# Altium schematic sheet PX4FMUv2.4.6_06.SchDoc: PX4FMUv2.4.6.sch
size 282 x 200 mm; Date: 2015/3/26 21:06:19; SheetNumber: Sheet:
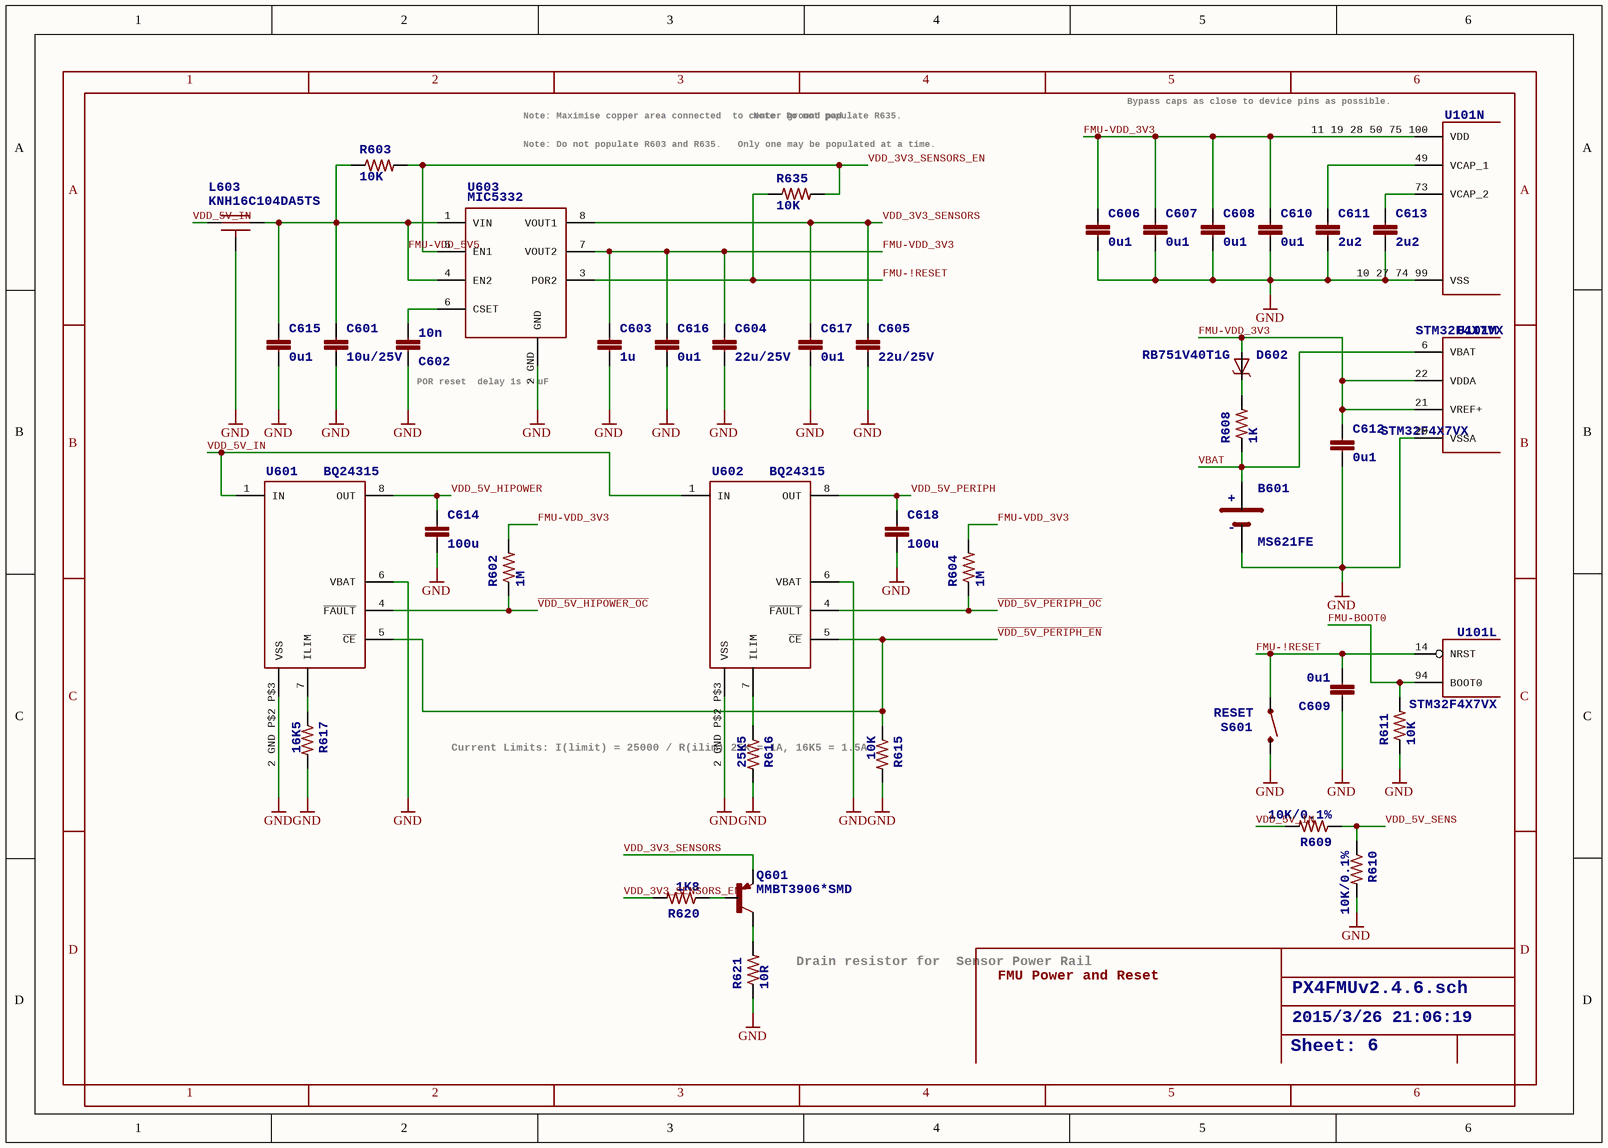
[diagram p0: PX4FMUv2.4.6_06.SchDoc]

## Parts
B601  MS621FE  [MS621FE]
C601  10u/25V  [0805-CAP]
C602  10n  [0402-CAP]
C603  1u  [0603-CAP]
C604  22u/25V  [0805-CAP]
C605  22u/25V  [0805-CAP]
C606  0u1  [0402-CAP]
C607  0u1  [0402-CAP]
C608  0u1  [0402-CAP]
C609  0u1  [0402-CAP]
C610  0u1  [0402-CAP]
C611  2u2  [0603-CAP]
C612  0u1  [0402-CAP]
C613  2u2  [0603-CAP]
C614  100u  [1206-CAP]
C615  0u1  [0402-CAP]
C616  0u1  [0402-CAP]
C617  0u1  [0402-CAP]
C618  100u  [1206-CAP]
D602  RB751V40T1G  [SOD323]
L603  KNH16C104DA5TS  [KYOCERA-KNH16-DA]
Q601  MMBT3906*SMD  [SOT23-BEC]
R602  1M  [0402-RES]
R603  10K  [0402-RES]
R604  1M  [0402-RES]
R608  1K  [0402-RES]
R609  10K/0.1%  [0402-RES]
R610  10K/0.1%  [0402-RES]
R611  10K  [0402-RES]
R615  10K  [0402-RES]
R616  25K5  [0402-RES]
R617  16K5  [0402-RES]
R620  1K8  [0402-RES]
R621  10R  [0603-RES]
R635  10K  [0402-RES]
S601  RESET  [EVQP7J01K]
U101  STM32F4X7VX  [TQFP100]  (parts L,M,N of 14)
U601  BQ24315  [QFN8-DSG]
U602  BQ24315  [QFN8-DSG]
U603  MIC5332  [MLF-8-EPAD]

## Nets
GND: B601.2(NEG) C601.P$2 C602.P$1 C603.P$2 C604.P$2 C605.P$2 C606.P$2 C607.P$2 C608.P$2 C609.P$1 C610.P$2 C611.P$2 C612.P$2 C613.P$2 C614.P$2 C615.P$2 C616.P$2 C617.P$2 C618.P$2 L603.P$3_P$4_P$5(P$3) R610.P$2 R611.P$1 R615.P$2 R616.P$2 R617.P$2 R621.1 S601.B3 U101.10_27_74_99(VSS) U101.20(VSSA) U601.2_GND_P$2_P$3(VSS) U601.6(VBAT) U602.2_GND_P$2_P$3(VSS) U602.6(VBAT) U603.2_GND(GND)
FMU-!RESET: C609.P$2 R635.P$1 S601.A1 U101.14(NRST) U603.3(POR2)
FMU-BOOT0: R611.P$2 U101.94(BOOT0)
FMU-VDD_3V3: C603.P$1 C604.P$1 C606.P$1 C607.P$1 C608.P$1 C610.P$1 C612.P$1 C616.P$1 D602.A R602.P$2 R604.P$2 U101.11_19_28_50_75_100(VDD) U101.21(VREF+) U101.22(VDDA) U603.7(VOUT2)
FMU-VDD_5V5: C601.P$1 C615.P$1 L603.P$2 R603.P$1 U603.1(VIN) U603.4(EN2)
~{VDD_5V_HIPOWER_OC}: R602.P$1 U601.4(~{FAULT})
~{VDD_5V_PERIPH_EN}: R615.P$1 U601.5(~{CE}) U602.5(~{CE})
~{VDD_5V_PERIPH_OC}: R604.P$1 U602.4(~{FAULT})
VBAT: B601.1(POS) R608.P$1 U101.6(VBAT)
VDD_3V3_SENSORS: C605.P$1 C617.P$1 Q601.E U603.8(VOUT1)
VDD_3V3_SENSORS_EN: R603.P$2 R620.P$2 R635.P$2 U603.5(EN1)
VDD_5V_HIPOWER: C614.P$1 U601.8(OUT)
VDD_5V_IN: L603.P$1 R609.P$2 U601.1(IN) U602.1(IN)
VDD_5V_PERIPH: C618.P$1 U602.8(OUT)
VDD_5V_SENS: R609.P$1 R610.P$1
NetC602_P$2: C602.P$2 U603.6(CSET)
NetC611_P$1: C611.P$1 U101.49(VCAP_1)
NetC613_P$1: C613.P$1 U101.73(VCAP_2)
NetD602_C: D602.C R608.P$2
NetQ601_B: Q601.B R620.P$1
NetQ601_C: Q601.C R621.2
NetR616_P$1: R616.P$1 U602.7(ILIM)
NetR617_P$1: R617.P$1 U601.7(ILIM)

## Notes on the sheet
- Note: Maximise copper area connected
  to center ground pad.
- (near R635) Note: Do not populate R603 and R635.
  Only one may be populated at a time.
- Note: Do not populate R635.
- Bypass caps as close to device pins as possible.
- POR reset
  delay 1s / uF
- (near R616) Current Limits:
  I(limit) = 25000 / R(ilim)
  25K = 1A, 16K5 = 1.5A
- Drain resistor for
  Sensor Power Rail
- FMU Power and Reset
- 1
- 2
- 3
- 4
- 5
- 6
- A
- B
- C
- D

## Library data of the parts
B601 = MS621FE: <b>SEIKO 6.8mm Rechargeable 3V lithium battery<b> / <br> / <br> / <b>If discontinued or not available, similar devices are available from Panasonic and Sanyo, usually direct replacements.<b>; PARTNO: MS621FE-FL11E; DATASHEET: http://speed.sii.co.jp/data/file_PRODUCT_MASTER_50112_TITLE_IMAGESP.pdf; LINK: http://search.digikey.com/us/en/products/MS621FE-FL11E/728-1057-ND/1889208; MFGPN: MS621FE; +: +; -: -
C601 = CAP0805: <b>Capacitor</b> / Standard 0603 ceramic capacitor, and 0.1" leaded capacitor.; PARTNO: CL21A106KAYNNNE
C602 = CAP0402: <b>Capacitor</b> / Standard 0603 ceramic capacitor, and 0.1" leaded capacitor.; PARTNO: CC0402KRX7R7BB103
C603 = CAP0603: <b>Capacitor</b> / Standard 0603 ceramic capacitor, and 0.1" leaded capacitor.; PARTNO: CC0603ZRY5V7BB105
C604 C605 = CAP0805: <b>Capacitor</b> / Standard 0603 ceramic capacitor, and 0.1" leaded capacitor.; PARTNO: CL21A226MAQNNNE
C606-C610 C612 C615-C617 = CAP0402: <b>Capacitor</b> / Standard 0603 ceramic capacitor, and 0.1" leaded capacitor.; PARTNO: CC0402ZRY5V7BB104
C611 C613 = CAP0603: <b>Capacitor</b> / Standard 0603 ceramic capacitor, and 0.1" leaded capacitor.; PARTNO: C1608X6S1C225K080AC
C614 C618 = CAP1206: <b>Capacitor</b> / Standard 0603 ceramic capacitor, and 0.1" leaded capacitor.; PARTNO: C3216X5R1A107M160AC
D602 = DIODE-SCHOTTKY_SOD323: Schottky barrier diode in DO214AC, e.g. Fairchild SS14.
L603 = KNH16C104DA5TS: Kyocera KNH16C104DA5TS EMI filter; PARTNO: KNH16C104DA5TS
Q601 = MMBT3906*SMD: <b>PNP Transistror</b>
R602 R604 = RESISTOR0402-RES: <b>Resistor</b> / Basic schematic elements and footprints for 0603, 1206, and PTH 1/10th watt (small) resistors.; PARTNO: RC0402FR-071ML
R603 R611 R615 = RESISTOR0402-RES: <b>Resistor</b> / Basic schematic elements and footprints for 0603, 1206, and PTH 1/10th watt (small) resistors.; PARTNO: RC0402FR-0710KL
R608 = RESISTOR0402-RES: <b>Resistor</b> / Basic schematic elements and footprints for 0603, 1206, and PTH 1/10th watt (small) resistors.; PARTNO: RC0402FR-071KL
R609 R610 = RESISTOR0402-RES: <b>Resistor</b> / Basic schematic elements and footprints for 0603, 1206, and PTH 1/10th watt (small) resistors.; PARTNO: ERA-2AEB103X
R616 = RESISTOR0402-RES: <b>Resistor</b> / Basic schematic elements and footprints for 0603, 1206, and PTH 1/10th watt (small) resistors.; PARTNO: RMCF0402FT25K5
R617 = RESISTOR0402-RES: <b>Resistor</b> / Basic schematic elements and footprints for 0603, 1206, and PTH 1/10th watt (small) resistors.; PARTNO: RMCF0402FT16K5
R620 = RESISTOR0402-RES: <b>Resistor</b> / Basic schematic elements and footprints for 0603, 1206, and PTH 1/10th watt (small) resistors.; PARTNO: RC1005F182CS
R621 = RESISTOR0603-RES: <b>Resistor</b> / Basic schematic elements and footprints for 0603, 1206, and PTH 1/10th watt (small) resistors.; PARTNO: RC1608J100CS
R635 = RESISTOR0402-RES: <b>Resistor</b> / Basic schematic elements and footprints for 0603, 1206, and PTH 1/10th watt (small) resistors.; PARTNO: RC0402FR-0710KL; BOM: EXCLUDE
S601 = SWITCH-MOMENTARY-2
U101 = STM32F4X7VX: STM32F4X7VX 100 pin LQFP / STM32F407VE - 512 KB flash, no crypto / STM32F407VG - 1 MB flash, no crypto / STM32F417VE - 512 KB flash, with crypto / STM32F417VG - 1 MB flash, with crypto; PARTNO: STM32F427VI
U601 U602 = BQ24315: PARTNO: BQ24315DSGR
U603 = MIC5332: PARTNO: MIC5332-SSYMT